# Altium schematic sheet 5-PWR_ADC.SCHDOC
size A4
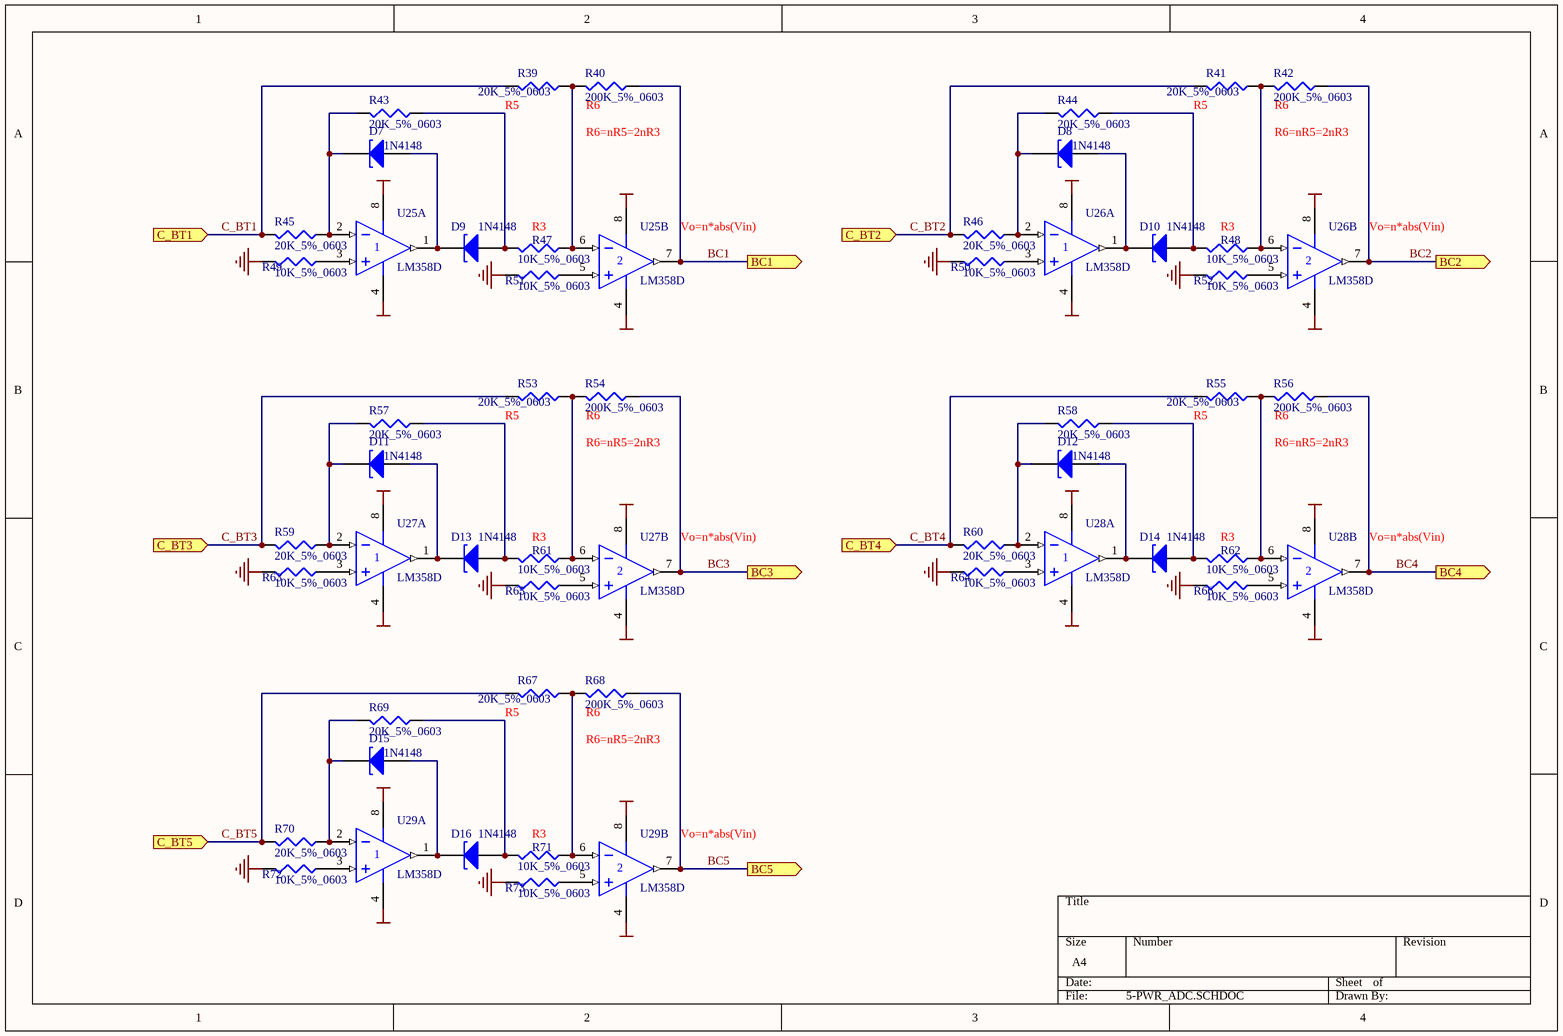
[diagram p0: 5-PWR_ADC.SCHDOC]

## Parts
D7  1N4148  [DSO-F2/D6.1]
D8  1N4148  [DSO-F2/D6.1]
D9  1N4148  [DSO-F2/D6.1]
D10  1N4148  [DSO-F2/D6.1]
D11  1N4148  [DSO-F2/D6.1]
D12  1N4148  [DSO-F2/D6.1]
D13  1N4148  [DSO-F2/D6.1]
D14  1N4148  [DSO-F2/D6.1]
D15  1N4148  [DSO-F2/D6.1]
D16  1N4148  [DSO-F2/D6.1]
R39  20K_5%_0603  [C1608-0603]
R40  200K_5%_0603  [C1608-0603]
R41  20K_5%_0603  [C1608-0603]
R42  200K_5%_0603  [C1608-0603]
R43  20K_5%_0603  [C1608-0603]
R44  20K_5%_0603  [C1608-0603]
R45  20K_5%_0603  [C1608-0603]
R46  20K_5%_0603  [C1608-0603]
R47  10K_5%_0603  [C1608-0603]
R48  10K_5%_0603  [C1608-0603]
R49  10K_5%_0603  [C1608-0603]
R50  10K_5%_0603  [C1608-0603]
R51  10K_5%_0603  [C1608-0603]
R52  10K_5%_0603  [C1608-0603]
R53  20K_5%_0603  [C1608-0603]
R54  200K_5%_0603  [C1608-0603]
R55  20K_5%_0603  [C1608-0603]
R56  200K_5%_0603  [C1608-0603]
R57  20K_5%_0603  [C1608-0603]
R58  20K_5%_0603  [C1608-0603]
R59  20K_5%_0603  [C1608-0603]
R60  20K_5%_0603  [C1608-0603]
R61  10K_5%_0603  [C1608-0603]
R62  10K_5%_0603  [C1608-0603]
R63  10K_5%_0603  [C1608-0603]
R64  10K_5%_0603  [C1608-0603]
R65  10K_5%_0603  [C1608-0603]
R66  10K_5%_0603  [C1608-0603]
R67  20K_5%_0603  [C1608-0603]
R68  200K_5%_0603  [C1608-0603]
R69  20K_5%_0603  [C1608-0603]
R70  20K_5%_0603  [C1608-0603]
R71  10K_5%_0603  [C1608-0603]
R72  10K_5%_0603  [C1608-0603]
R73  10K_5%_0603  [C1608-0603]
U25  LM358D  [751-02]  (parts A,B of 2)
U26  LM358D  [751-02]  (parts A,B of 2)
U27  LM358D  [751-02]  (parts A,B of 2)
U28  LM358D  [751-02]  (parts A,B of 2)
U29  LM358D  [751-02]  (parts A,B of 2)

## Ports
BC1 (out), BC2 (out), BC3 (out), BC4 (out), BC5 (out), C_BT1 (in), C_BT2 (in), C_BT3 (in), C_BT4 (in), C_BT5 (in)

## Nets
GND: R49.2 R50.2 R51.2 R52.2 R63.2 R64.2 R65.2 R66.2 R72.2 R73.2
VCC_3V3: U25.8(V+) U26.8(V+) U27.8(V+) U28.8(V+) U29.8(V+)
VCC_-3V3: U25.4(V-) U26.4(V-) U27.4(V-) U28.4(V-) U29.4(V-)
BC1: R40.1 U25.7(OUT) ; port BC1
BC2: R42.1 U26.7(OUT) ; port BC2
BC3: R54.1 U27.7(OUT) ; port BC3
BC4: R56.1 U28.7(OUT) ; port BC4
BC5: R68.1 U29.7(OUT) ; port BC5
C_BT1: R39.2 R45.2 ; port C_BT1
C_BT2: R41.2 R46.2 ; port C_BT2
C_BT3: R53.2 R59.2 ; port C_BT3
C_BT4: R55.2 R60.2 ; port C_BT4
C_BT5: R67.2 R70.2 ; port C_BT5
NetD7_1: D7.1(A) D9.2(K) U25.1(OUT)
NetD7_2: D7.2(K) R43.2 R45.1 U25.2(IN-)
NetD8_1: D8.1(A) D10.2(K) U26.1(OUT)
NetD8_2: D8.2(K) R44.2 R46.1 U26.2(IN-)
NetD9_1: D9.1(A) R43.1 R47.2
NetD10_1: D10.1(A) R44.1 R48.2
NetD11_1: D11.1(A) D13.2(K) U27.1(OUT)
NetD11_2: D11.2(K) R57.2 R59.1 U27.2(IN-)
NetD12_1: D12.1(A) D14.2(K) U28.1(OUT)
NetD12_2: D12.2(K) R58.2 R60.1 U28.2(IN-)
NetD13_1: D13.1(A) R57.1 R61.2
NetD14_1: D14.1(A) R58.1 R62.2
NetD15_1: D15.1(A) D16.2(K) U29.1(OUT)
NetD15_2: D15.2(K) R69.2 R70.1 U29.2(IN-)
NetD16_1: D16.1(A) R69.1 R71.2
NetR39_1: R39.1 R40.2 R47.1 U25.6(IN-)
NetR41_1: R41.1 R42.2 R48.1 U26.6(IN-)
NetR49_1: R49.1 U25.3(IN+)
NetR50_1: R50.1 U26.3(IN+)
NetR51_1: R51.1 U25.5(IN+)
NetR52_1: R52.1 U26.5(IN+)
NetR53_1: R53.1 R54.2 R61.1 U27.6(IN-)
NetR55_1: R55.1 R56.2 R62.1 U28.6(IN-)
NetR63_1: R63.1 U27.3(IN+)
NetR64_1: R64.1 U28.3(IN+)
NetR65_1: R65.1 U27.5(IN+)
NetR66_1: R66.1 U28.5(IN+)
NetR67_1: R67.1 R68.2 R71.1 U29.6(IN-)
NetR72_1: R72.1 U29.3(IN+)
NetR73_1: R73.1 U29.5(IN+)

## Notes on the sheet
- (near R39) R5
- (near R40) R6
- (near R41) R5
- (near R42) R6
- R6=nR5=2nR3
- (near R47) R3
- (near U25) Vo=n*abs(Vin)
- (near R48) R3
- (near U26) Vo=n*abs(Vin)
- (near R53) R5
- (near R54) R6
- (near R55) R5
- (near R56) R6
- (near R61) R3
- (near U27) Vo=n*abs(Vin)
- (near R62) R3
- (near U28) Vo=n*abs(Vin)
- (near R67) R5
- (near R68) R6
- (near R71) R3
- (near U29) Vo=n*abs(Vin)

## Library data of the parts
D7-D16 = D Tunnel1: Tunnel Diode - RLC Model; Published: 8-Jun-2000; LatestRevisionDate: 17-Jul-2002; LatestRevisionNote: Re-released for DXP Platform.; Publisher: Altium Limited
R39-R73 = Res3: Resistor; Value: 150R %5 0603; Published: 8-Jun-2000; Revision: July-2002: Re-released for DXP Platform.; Publisher: Altium Limited
U25-U29 = LM358D: Dual Low-Power Operational Amplifier; Published: 17-Jul-2002; DatasheetDocument: 1988; PackageReference: 751-02; Publisher: Altium Limited; Code_JEDEC: MS-012-AA; Code_IPC: SO8